# EAGLE design HeatBed (EAGLE 7.4.0)
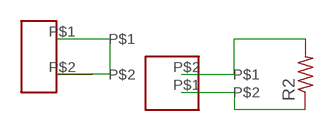
[diagram p0: schematic, sheet 1]

## Parts
R2  R-US_R0402  [R0402]
U$2  SMD_WAFER_2  [SMD_WAFER_02]
U$3  SMD_TERMINAL_2  [SMD_5MM_2]

## Nets
N$20: R2.2 U$2.P$2
N$21: R2.1 U$2.P$1
N$26: U$3.P$1 U$3.P$2

## Library data of the parts
R2 = rcl:R-US_: RESISTOR, American symbol
U$2 = Ateam_Eagle:SMD_WAFER_2
U$3 = Ateam_Eagle:SMD_TERMINAL_2

## Net classes
0 default: clearance 0.205 mm

## Board
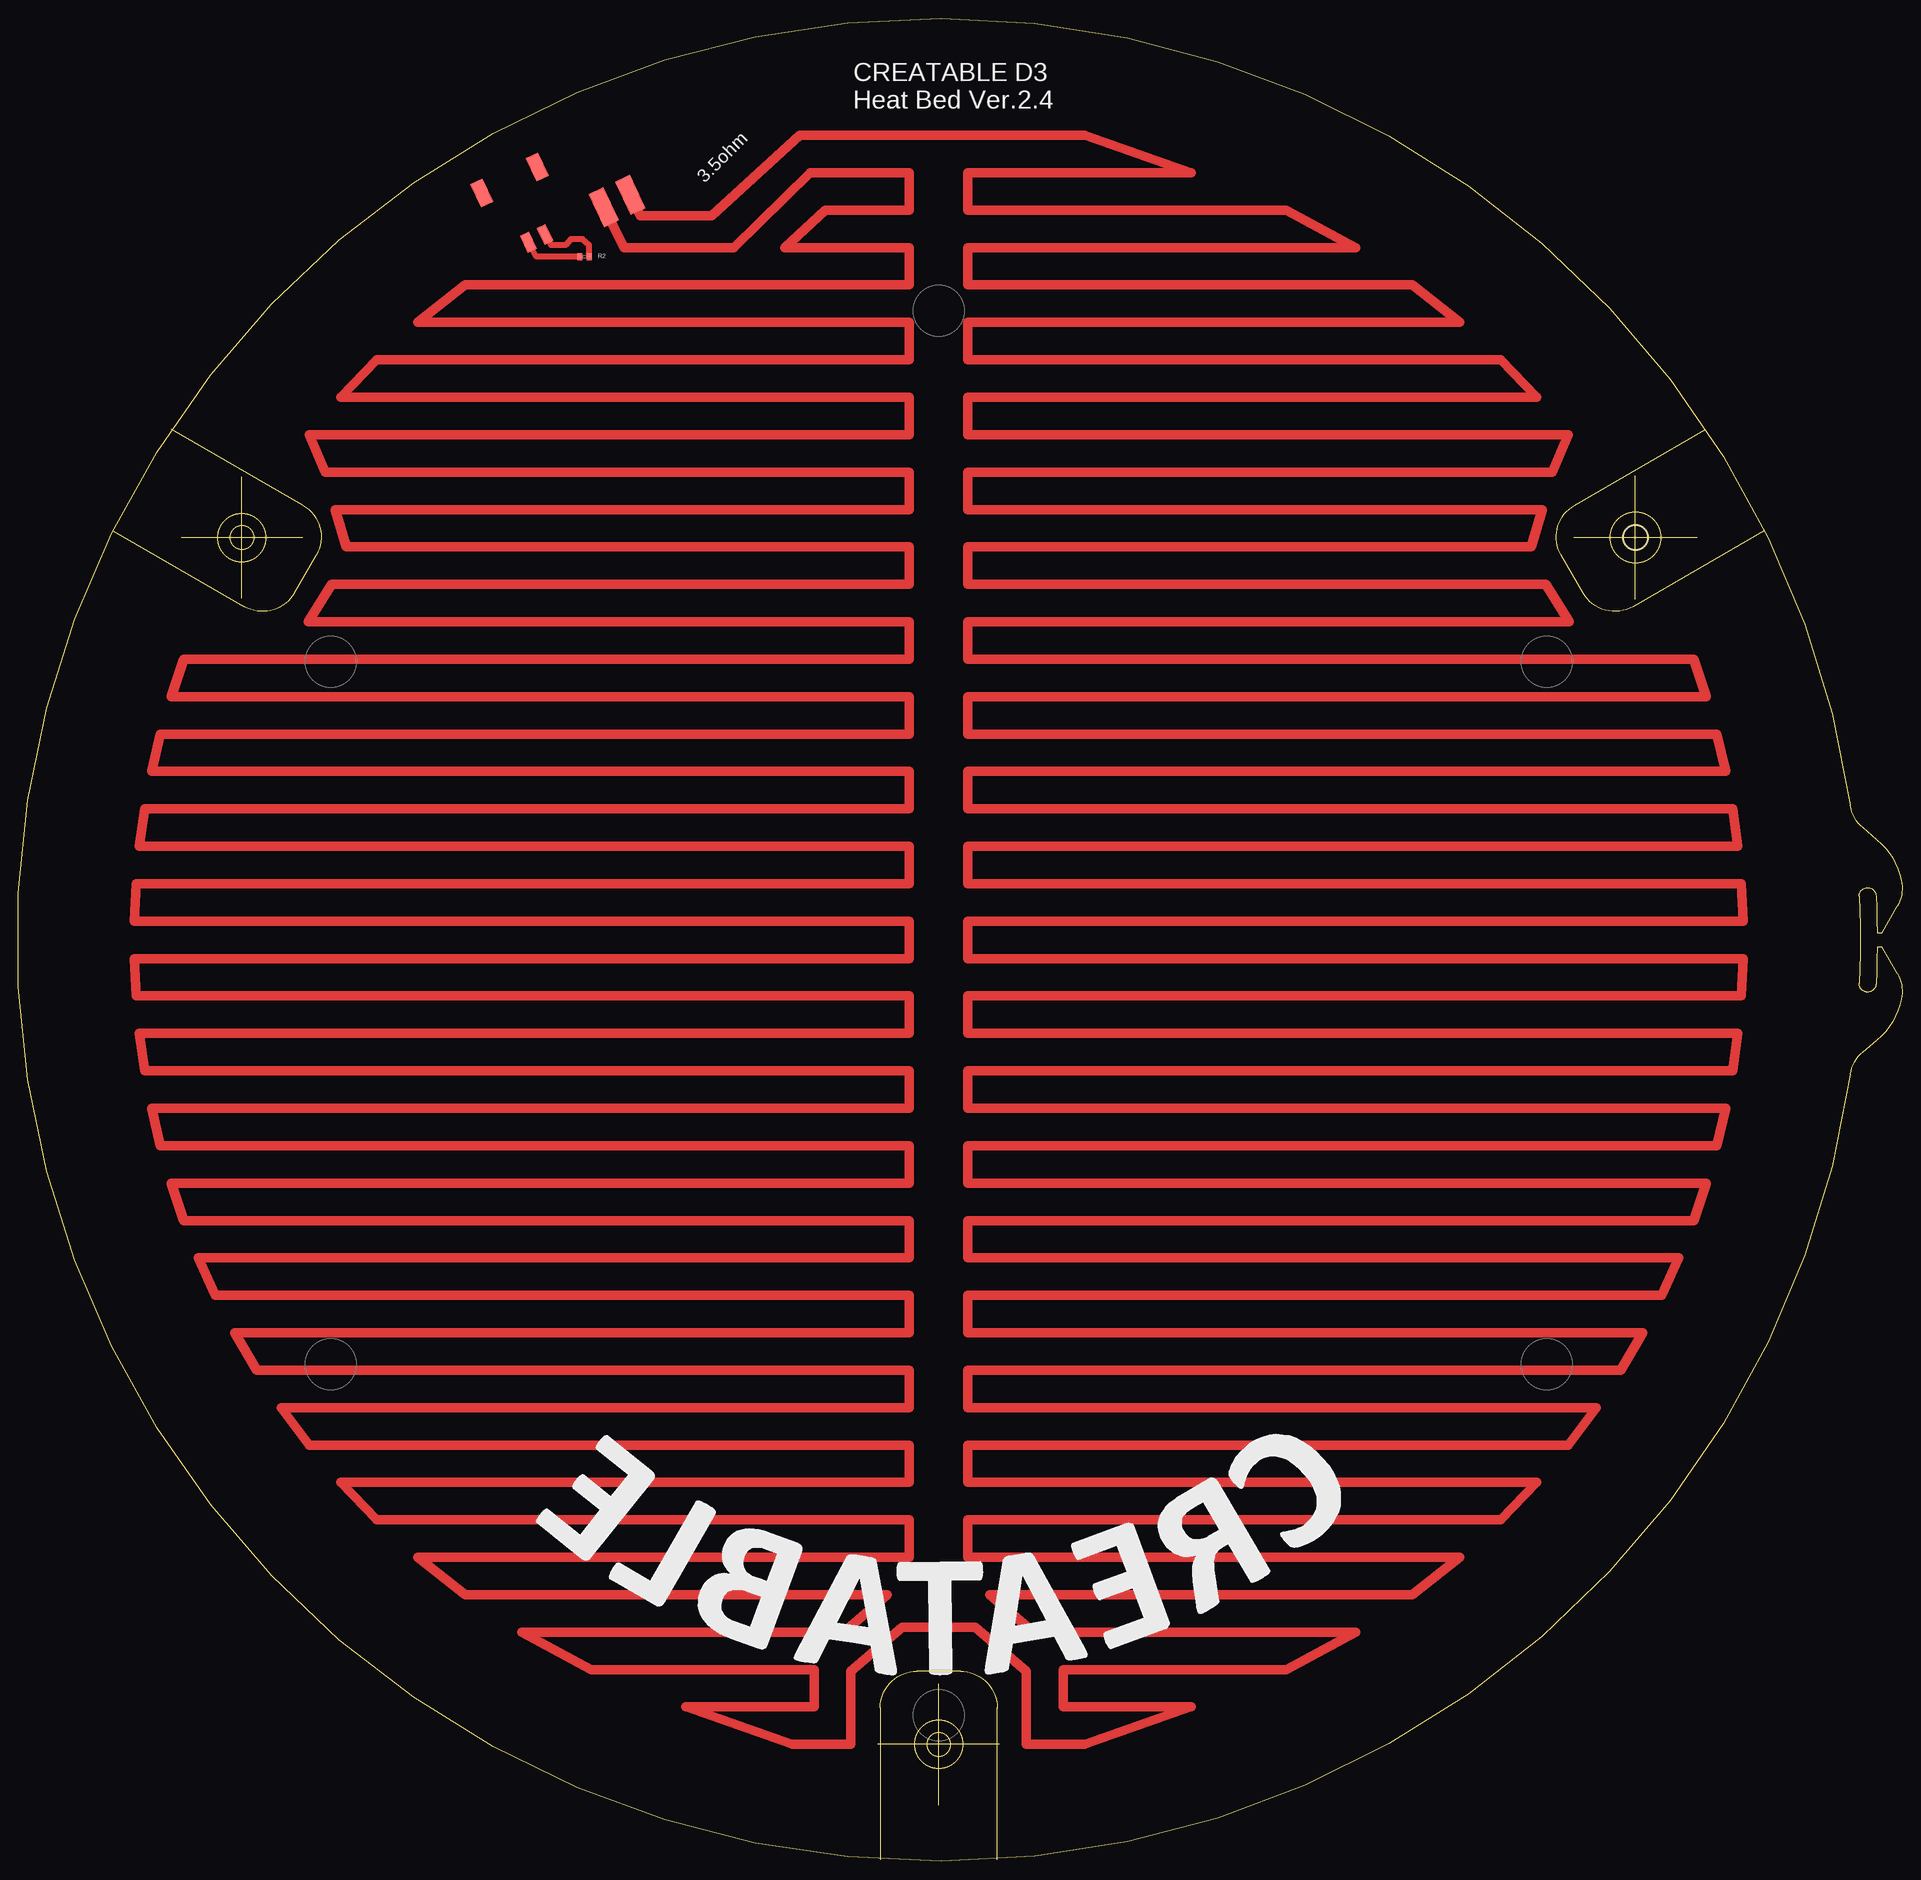
[diagram p1: board, top side]

Size 257.57 x 252 mm. Coordinates in mm from the lower left corner, seen from the top.
Copper layers (1*16): Top 0.035mm / dielectric 1.5mm / Bottom 0.035mm
Design rules "default": minimum track width 10mil, minimum drill 24mil, track to track 8mil, track to pad 8mil, pad to pad 8mil, via to via 8mil, smd to smd 8mil, copper to edge 40mil, drill to drill 8mil, minimum pad ring 10mil, minimum via ring 8mil, stop-mask expansion 4mil, vias tented up to drill 0mil, thermal gap 10mil

### Footprints (pad centres in the part's own frame; a part is rotated, then mirrored left to right if it is on the bottom)
R0402 = smd 0.7 x 0.9: 1 -0.65,0; 2 0.65,0
HEAT_BED2.3(R126_T2.3) = hole 3.2: -95.263,55; 95.263,55; 0,-110
SMD_WAFER_02 = smd 1.3 x 2.5: P$1 -1.25,10.75; P$2 1.25,10.75 | smd 1.8 x 3.5: P$3 -4.2,1.95; P$4 4.2,1.95
SMD_5MM_2 = smd 2.2 x 5: P$1 -2,0; P$2 2,0

### Placement (x,y rotation side)
R2  77.44,219.4 180 top
U$1  [HEAT_BED2.3(R126_T2.3)]  125.84,126 0 bottom
U$2  66.34,231.65 205 top
U$3  81.84,227 205 top
U$4  [CREATABLE_WORD]  125.14,103.6 0 top

### Tracks (layer width: path | path; a pad name or v marks a point on that pad's centre or on a via)
N$20
  Top 0.813: R2.2 70.84,219.4 U$2.P$2
N$21  (1 unrouted)
  Top 0.813: U$2.P$1 72.84,221 74.84,221 75.54,221.8 77.14,221.8 78.04,221 78.04,219.4
N$26
  Top 1.27: U$3.P$1 85.04,225 94.84,225 106.84,236 145.84,236 160.39,230.88 129.84,230.88 129.84,225.77 173.33,225.77 182.86,220.65 129.84,220.65 129.84,215.53 190.58,215.53 197.08,210.42 129.84,210.42 129.84,205.3 202.68,205.3 207.58,200.19 129.84,200.19 129.84,195.07 211.89,195.07 209.71,189.95 129.84,189.95 129.84,184.84 208.34,184.84 206.84,179.72 129.84,179.72 129.84,174.6 208.84,174.6 212.04,169.49 129.84,169.49 129.84,164.37 229.05,164.37 230.78,159.26 129.84,159.26 129.84,154.14 232.24,154.14 233.45,149.02 129.84,149.02 129.84,143.91 234.4,143.91 235.1,138.79 129.84,138.79 129.84,133.67 235.57,133.67 235.81,128.56 129.84,128.56 129.84,123.44 235.81,123.44 235.57,118.33 129.84,118.33 129.84,113.21 235.1,113.21 234.4,108.09 129.84,108.09 129.84,102.98 233.45,102.98 232.24,97.86 129.84,97.86 129.84,92.74 230.78,92.74 229.05,87.63 129.84,87.63 129.84,82.51 227.04,82.51 224.72,77.39 129.84,77.39 129.84,72.28 222.08,72.28 219.09,67.16 129.84,67.16 129.84,62.05 215.71,62.05 211.89,56.93 129.84,56.93 129.84,51.81 207.58,51.81 202.68,46.7 129.84,46.7 129.84,41.58 197.08,41.58 190.58,36.46 132.84,36.46 138.84,31.35 182.86,31.35 173.33,26.23 142.84,26.23 142.84,21.12 160.39,21.12 145.84,16 137.84,16 137.84,26 130.84,32 120.84,32 113.84,26 113.84,16 105.84,16 91.28,21.12 108.84,21.12 108.84,26.23 78.35,26.23 68.81,31.35 112.84,31.35 118.84,36.46 61.1,36.46 54.6,41.58 121.84,41.58 121.84,46.7 48.99,46.7 44.1,51.81 121.84,51.81 121.84,56.93 39.78,56.93 35.97,62.05 121.84,62.05 121.84,67.16 32.59,67.16 29.59,72.28 121.84,72.28 121.84,77.39 26.95,77.39 24.64,82.51 121.84,82.51 121.84,87.63 22.62,87.63 20.89,92.74 121.84,92.74 121.84,97.86 19.43,97.86 18.23,102.98 121.84,102.98 121.84,108.09 17.28,108.09 16.57,113.21 121.84,113.21 121.84,118.33 16.1,118.33 15.87,123.44 121.84,123.44 121.84,128.56 15.87,128.56 16.1,133.67 121.84,133.67 121.84,138.79 16.57,138.79 17.28,143.91 121.84,143.91 121.84,149.02 18.23,149.02 19.43,154.14 121.84,154.14 121.84,159.26 20.89,159.26 22.62,164.37 121.84,164.37 121.84,169.49 39.64,169.49 42.84,174.6 121.84,174.6 121.84,179.72 44.84,179.72 43.34,184.84 121.84,184.84 121.84,189.95 41.97,189.95 39.78,195.07 121.84,195.07 121.84,200.19 44.1,200.19 48.99,205.3 121.84,205.3 121.84,210.42 54.6,210.42 61.1,215.53 121.84,215.53 121.84,220.65 104.81,220.65 110.35,225.77 121.84,225.77 121.84,230.88 108.28,230.88 97.84,220.65 82.84,220.65 U$3.P$2

### Text on the board
tNames: CREATABLE D3 / Heat Bed Ver.2.4 | 3.5ohm
Document: Up